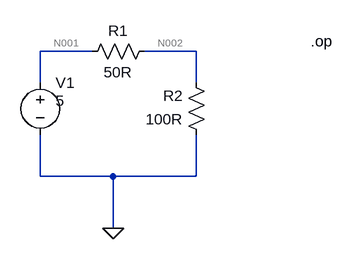
[diagram p0: schematic Draft1.asc]
Draft1.asc, the LTspice schematic file:
Version 4.1
SHEET 1 880 680
WIRE 96 80 16 80
WIRE 256 80 176 80
WIRE 16 128 16 80
WIRE 256 128 256 80
WIRE 16 272 16 208
WIRE 128 272 16 272
WIRE 256 272 256 208
WIRE 256 272 128 272
WIRE 128 352 128 272
FLAG 128 352 0
SYMBOL voltage 16 112 R0
WINDOW 3 24 44 Left 2
WINDOW 123 0 0 Left 0
WINDOW 39 0 0 Left 0
SYMATTR InstName V1
SYMATTR Value 5
SYMBOL res 192 64 R90
WINDOW 0 0 56 VBottom 2
WINDOW 3 32 56 VTop 2
SYMATTR InstName R1
SYMATTR Value 50R
SYMBOL res 272 224 R180
WINDOW 0 36 76 Left 2
WINDOW 3 36 40 Left 2
SYMATTR InstName R2
SYMATTR Value 100R
TEXT 432 64 Left 2 !.op

The netlist it stands for:
* Draft1.asc
V1 N001 0 5
R1 N002 N001 50R
R2 0 N002 100R
.op
.backanno
.end

* Results of the author's LTspice run, read from the files saved beside the schematic
* Operating Point:
*   V(n002) = 3.333 V
*   V(n001) = 5 V
*   I(V1) = -33.33 mA
*   I(R2) = -33.33 mA
*   I(R1) = -33.33 mA